# Altium schematic sheet Long Freq to Volt Converter.SchDoc: Thermistor Connections
size OrCAD A
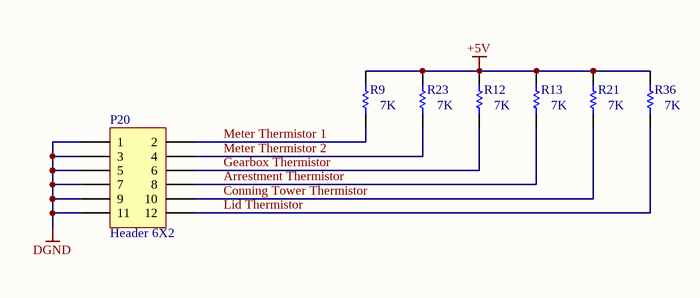
[diagram p0: Long Freq to Volt Converter.SchDoc]

## Parts
P20  Header 6X2  [HDR2X6]
R9  value 7K  [AXIAL-0.3]  (hidden comment: Res1)
R12  value 7K  [AXIAL-0.3]  (hidden comment: Res1)
R13  value 7K  [AXIAL-0.3]  (hidden comment: Res1)
R21  value 7K  [AXIAL-0.3]  (hidden comment: Res1)
R23  value 7K  [AXIAL-0.3]  (hidden comment: Res1)
R36  value 7K  [AXIAL-0.3]  (hidden comment: Res1)

## Nets
+5V: R9.2 R12.2 R13.2 R21.2 R23.2 R36.2
DGND: P20.1 P20.3 P20.5 P20.7 P20.9 P20.11
Arrestment Thermistor: P20.8 R13.1
Conning Tower Thermistor: P20.10 R21.1
Gearbox Thermistor: P20.6 R12.1
Lid Thermistor: P20.12 R36.1
Meter Thermistor 1: P20.2 R9.1
Meter Thermistor 2: P20.4 R23.1

## Notes on the sheet
- Title
- Size:
- Date:
- Orcad A
- Number:
- Time:
- Revision:
- Sheet
- of
- ZLS Corporation
- 7801 North Lamar Blvd
- Suite E-184
- Austin, TX  78752
- Phone: (512) 453-0288
- File:

## Library data of the parts
P20 = Header 6X2: Header, 6-Pin, Dual row; LatestRevisionDate: 17-Jul-2002; LatestRevisionNote: Re-released for DXP Platform.; Publisher: Altium Limited
R9 R12 R13 R21 R23 R36 = Res1: Resistor; Published: 8-Jun-2000; LatestRevisionDate: 17-Jul-2002; LatestRevisionNote: Re-released for DXP Platform.; PackageReference: AXIAL-0.3; Publisher: Altium Limited; PackageDescription: Axial Device, Thru-Hole; 2 Leads; 0.3 in Pin Spacing